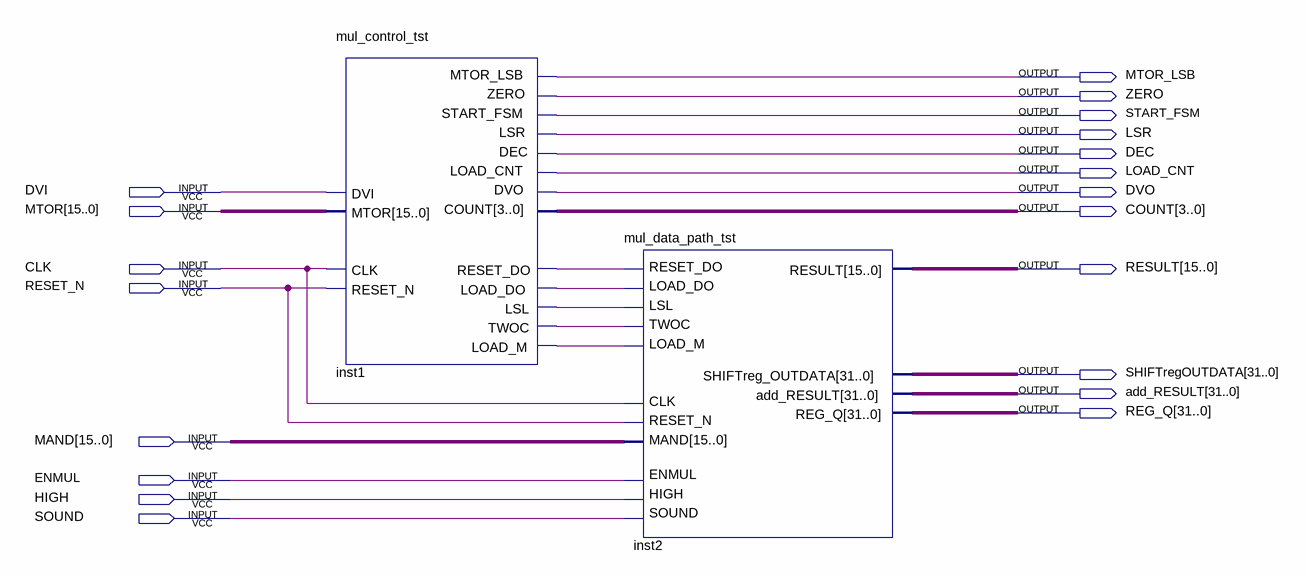
[diagram p0: schematic sheet]
// Quartus schematic mul_tst.bdf as structural Verilog: 2 symbols, 20 pins
module mul_tst (
  input  DVI,
  input  [15:0] MTOR,
  input  CLK,
  input  RESET_N,
  input  [15:0] MAND,
  input  ENMUL,
  input  HIGH,
  input  SOUND,
  output MTOR_LSB,
  output ZERO,
  output START_FSM,
  output LSR,
  output DEC,
  output LOAD_CNT,
  output DVO,
  output [3:0] COUNT,
  output [15:0] RESULT,
  output [31:0] SHIFTregOUTDATA,
  output [31:0] add_RESULT,
  output [31:0] REG_Q
);

  wire inst1_load_do, inst1_load_m, inst1_lsl, inst1_reset_do, inst1_twoc;

  mul_control_tst inst1 (
    .MTOR(MTOR), .CLK(CLK), .RESET_N(RESET_N), .DVI(DVI), .MTOR_LSB(MTOR_LSB), .COUNT(COUNT), .ZERO(ZERO),
    .START_FSM(START_FSM), .DVO(DVO), .LOAD_M(inst1_load_m), .DEC(DEC), .LSL(inst1_lsl), .LSR(LSR),
    .TWOC(inst1_twoc), .LOAD_DO(inst1_load_do), .RESET_DO(inst1_reset_do), .LOAD_CNT(LOAD_CNT));
  mul_data_path_tst inst2 (
    .TWOC(inst1_twoc), .MAND(MAND), .LSL(inst1_lsl), .LOAD_M(inst1_load_m), .CLK(CLK),
    .LOAD_DO(inst1_load_do), .RESET_N(RESET_N), .RESET_DO(inst1_reset_do), .HIGH(HIGH), .SOUND(SOUND),
    .ENMUL(ENMUL), .add_RESULT(add_RESULT), .SHIFTreg_OUTDATA(SHIFTregOUTDATA), .REG_Q(REG_Q), .RESULT(RESULT));
endmodule
